# Altium project Vertex-H7.PrjPcb
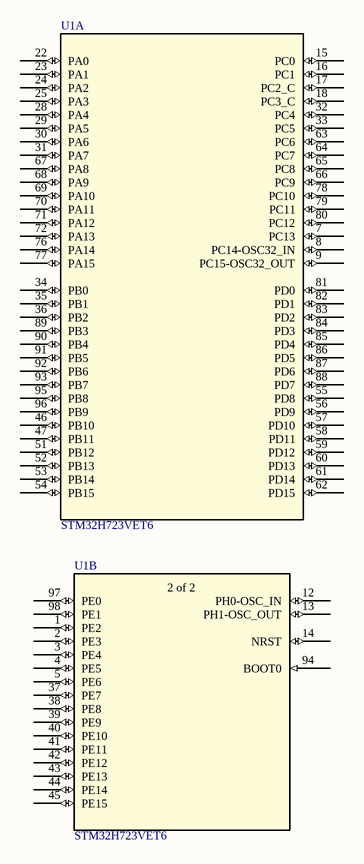
[diagram p0: MAIN.SchDoc]
4 sheets, 25 parts. Net scope: global (net labels, ports and power ports of the same name join across sheets).
Sheets:
  MAIN.SchDoc
  SDRAM.SchDoc
  POWER.SchDoc
  USB.SchDoc

## Sheet MAIN.SchDoc
size A4; SheetNumber: 1; SheetTotal: 3

### Parts
U1  STM32H723VET6  [LQFP100_STM]  (parts A,B of 3)

### Nets

Not connected (* = marked no-connect by the designer): U1 1(PE2) 2(PE3) 3(PE4) 4(PE5) 5(PE6) 7(PC13) 8(PC14-OSC32_IN) 9(PC15-OSC32_OUT) 12(PH0-OSC_IN) 13(PH1-OSC_OUT) 14(NRST) 15(PC0) 16(PC1) 17(PC2_C) 18(PC3_C) 22(PA0) 23(PA1) 24(PA2) 25(PA3) 28(PA4) 29(PA5) 30(PA6) 31(PA7) 32(PC4) 33(PC5) 34(PB0) 35(PB1) 36(PB2) 37(PE7) 38(PE8) 39(PE9) 40(PE10) 41(PE11) 42(PE12) 43(PE13) 44(PE14) 45(PE15) 46(PB10) 47(PB11) 51(PB12) 52(PB13) 53(PB14) 54(PB15) 55(PD8) 56(PD9) 57(PD10) 58(PD11) 59(PD12) 60(PD13) 61(PD14) 62(PD15) 63(PC6) 64(PC7) 65(PC8) 66(PC9) 67(PA8) 68(PA9) 69(PA10) 70(PA11) 71(PA12) 72(PA13) 76(PA14) 77(PA15) 78(PC10) 79(PC11) 80(PC12) 81(PD0) 82(PD1) 83(PD2) 84(PD3) 85(PD4) 86(PD5) 87(PD6) 88(PD7) 89(PB3) 90(PB4) 91(PB5) 92(PB6) 93(PB7) 94(BOOT0) 95(PB8) 96(PB9) 97(PE0) 98(PE1)

### Notes on the sheet
- (in symbol STM32H723VET6, part B) 2 of 2

### Library data of the parts
U1 = STM32H723VET6: High-performance and DSP with DP-FPU, Arm Cortex-M7 MCU with 512 Kbytes Flash, 564 Kbytes RAM, 550 MHz CPU, L1 cache, external memory interface, subset of peripherals; Manufacturer_Name: STMicroelectronics; Copyright: Copyright (C) 2025 Ultra Librarian. All rights reserved.; Manufacturer_Part_Number: STM32H723VET6; Datasheet: https://www.st.com/resource/en/datasheet/stm32h723ve.pdf; RefDes: RefDes; Type: Type

## Sheet SDRAM.SchDoc
size A4; SheetNumber: 2; SheetTotal: 4
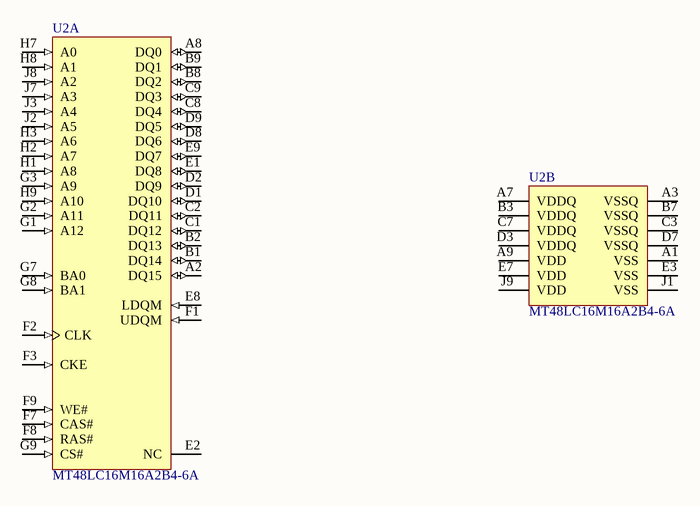
[diagram p1: SDRAM.SchDoc]

### Parts
U2  MT48LC16M16A2B4-6A  [MICT-B4-54]  (parts A,B of 2)

### Nets

Not connected (* = marked no-connect by the designer): U2 A1(VSS) A2(DQ15) A3(VSSQ) A7(VDDQ) A8(DQ0) A9(VDD) B1(DQ14) B2(DQ13) B3(VDDQ) B7(VSSQ) B8(DQ2) B9(DQ1) C1(DQ12) C2(DQ11) C3(VSSQ) C7(VDDQ) C8(DQ4) C9(DQ3) D1(DQ10) D2(DQ9) D3(VDDQ) D7(VSSQ) D8(DQ6) D9(DQ5) E1(DQ8) E2(NC) E3(VSS) E7(VDD) E8(LDQM) E9(DQ7) F1(UDQM) F2(CLK) F3(CKE) F7(CAS#) F8(RAS#) F9(WE#) G1(A12) G2(A11) G3(A9) G7(BA0) G8(BA1) G9(CS#) H1(A8) H2(A7) H3(A6) H7(A0) H8(A1) H9(A10) J1(VSS) J2(A5) J3(A4) J7(A3) J8(A2) J9(VDD)

### Library data of the parts
U2 = CMP-0351-00014-1: 256Mb PC133 SDR SDRAM, 16Mb x 16, 6ns, 3.3V, 0 to 70 degC, 54-Ball VFBGA, Pb-Free; Manufacturer: Micron; Data Rate: PC133Â; CL: CL = 3Â; Clock Rate: 166 MHzÂ; Cycle Time: 6nsÂ; Density: 256MbÂ; Voltage: 3.3VÂ; Op. Temp.: 0C to +70CÂ; PackageReference: MICT-B4-54; PartNumber: MT48LC16M16A2B4-6A; ComponentLink1URL: http://www.micron.com/; Mounting Technology: Surface Mount; DatasheetVersion: Rev.Q; ComponentLink1Description: Manufacturer URL; RoHS: YesÂ; Depth: 16MbÂ; ComponentLink2URL: http://www.micron.com/~/media/Documents/Products/Data%20Sheet/DRAM/256Mb_sdr.pdf; ComponentLink2Description: Datasheet; PackageDescription: 54-Ball Very Thin Profile Fine-Pitch Ball Grid Array, 8x 8 mm, Pitch 0.8 mm; ComponentLink3Description: Package Specification; Width: x16Â; ComponentLink3URL: http://www.micron.com/~/media/Documents/Products/Data%20Sheet/DRAM/128Mbx16x32Mobile.pdf; PackageVersion: Rev.Q

## Sheet POWER.SchDoc
size A4; SheetNumber: 3; SheetTotal: 4
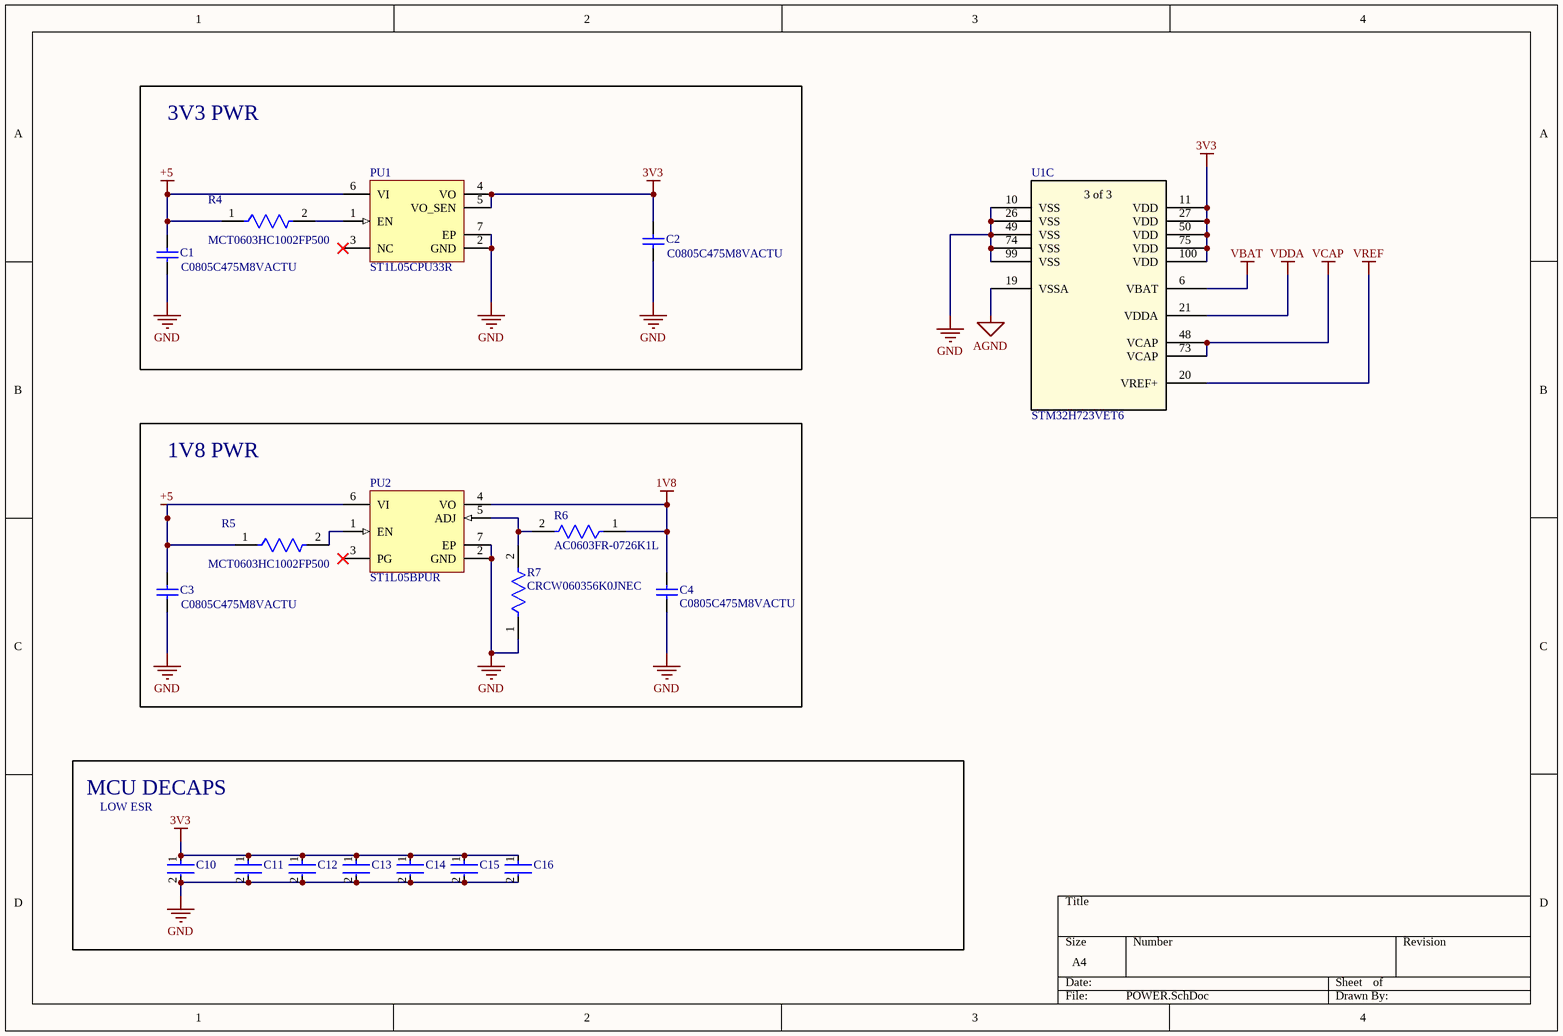
[diagram p2: POWER.SchDoc]

### Parts
C1  C0805C475M8VACTU  [CAPC2013X145X50ML20T25]
C2  C0805C475M8VACTU  [CAPC2013X145X50ML20T25]
C3  C0805C475M8VACTU  [CAPC2013X145X50ML20T25]
C4  C0805C475M8VACTU  [CAPC2013X145X50ML20T25]
C10  C0603X6S1C104K030BC  [FP-C0603-030-0_03-IPC_B]  (value not drawn)
C11  C0603X6S1C104K030BC  [FP-C0603-030-0_03-IPC_B]  (value not drawn)
C12  C0603X6S1C104K030BC  [FP-C0603-030-0_03-IPC_B]  (value not drawn)
C13  C0603X6S1C104K030BC  [FP-C0603-030-0_03-IPC_B]  (value not drawn)
C14  C0603X6S1C104K030BC  [FP-C0603-030-0_03-IPC_B]  (value not drawn)
C15  C0603X6S1C104K030BC  [FP-C0603-030-0_03-IPC_B]  (value not drawn)
C16  C0603X6S1C104K030BC  [FP-C0603-030-0_03-IPC_B]  (value not drawn)
PU1  ST1L05CPU33R  [DFN6D_N]
PU2  ST1L05BPUR  [DFN6D_M]
R4  MCT0603HC1002FP500  [FP-MCT0603-IPC_B]
R5  MCT0603HC1002FP500  [FP-MCT0603-IPC_B]
R6  AC0603FR-0726K1L  [FP-AC0603-MFG]
R7  CRCW060356K0JNEC  [FP-CRCW0603-e3-IPC_A]
U1  STM32H723VET6  [LQFP100_STM]  (part C of 3)

### Blocks framed on the sheet
3V3 PWR: C1 C2 PU1 R4
1V8 PWR: C3 C4 PU2 R5-R7
MCU DECAPS: C10-C16

### Nets
1V8: C4.2 PU2.4(VO) R6.1
3V3: C2.2 C10.1 C11.1 C12.1 C13.1 C14.1 C15.1 C16.1 PU1.4(VO) PU1.5(VO_SEN) U1.11(VDD) U1.27(VDD) U1.50(VDD) U1.75(VDD) U1.100(VDD)
+5: C1.2 C3.2 PU1.6(VI) PU2.6(VI) R4.1 R5.1
AGND: U1.19(VSSA)
GND: C1.1 C2.1 C3.1 C4.1 C10.2 C11.2 C12.2 C13.2 C14.2 C15.2 C16.2 PU1.2(GND) PU1.7(EP) PU2.2(GND) PU2.7(EP) R7.1 U1.10(VSS) U1.26(VSS) U1.49(VSS) U1.74(VSS) U1.99(VSS)
VBAT: U1.6(VBAT)
VCAP: U1.48(VCAP) U1.73(VCAP)
VDDA: U1.21(VDDA)
VREF: U1.20(VREF+)
NetPU1_1: PU1.1(EN) R4.2
NetPU2_1: PU2.1(EN) R5.2
NetPU2_5: PU2.5(ADJ) R6.2 R7.2

Not connected (* = marked no-connect by the designer): PU1 3(NC)*; PU2 3(PG)*

### Notes on the sheet
- LOW ESR
- (in symbol STM32H723VET6, part C) 3 of 3

### Library data of the parts
C1-C4 = CMP-2007-01267-1: Manufacturer: Kemet; Part Number: C0805C475M8VACTU
C10-C16 = CMP-08246-003275-1: Multilayer Ceramic Capacitors 100nF ±10% 16V X6S SMD 0201; Max Operating Temperature: 105°C; Tolerance: 10%; Termination: SMD/SMT; Mount: Surface Mount; Case Code (Imperial): 0201; Package Quantity: 1; RoHS Compliant: Yes; Voltage Rating (DC): 16V; Capacitance: 100nF; REACH SVHC: No SVHC; Lead Free: Lead Free; Min Operating Temperature: -55°C; Dielectric Material: Ceramic; Dielectric: X6S; Case/Package: 0201; Length: 0.024inch; Weight: 6E-06oz; Case Code (Metric): 0603; Width: 0.3mm; Voltage Rating: 16V; Height: 0.3mm; Packaging: Tape and Reel; Thickness: 0.013inch
PU1 = CMP-0244-00293-1: Very Low Quiescent BiCMOS Voltage Regulator, 3.3V, 6-Pin VFDFPN, Tape and Reel; ComponentLink2Description: Datasheet; ComponentLink1Description: Manufacturer URL; ComponentLink2URL: http://www.st.com/internet/com/TECHNICAL_RESOURCES/TECHNICAL_LITERATURE/DATASHEET/CD00186925.pdf; PackageVersion: 2008; PackageReference: DFN6D; PackageDescription: 6-Pin Plastic, Dual LLP, 3 x 3 mm Body, 0.95 mm Pitch, Exposed Pad; DatasheetVersion: 1/09/2009; ComponentLink1URL: http://www.st.com
PU2 = CMP-0244-00292-1: Very Low Quiescent BiCMOS Voltage Regulator, Adjustable Vo, 6-Pin VFDFPN, Tape and Reel; PackageDescription: 6-Pin Plastic, Dual LLP, 3 x 3 mm Body, 0.95 mm Pitch, Exposed Pad; ComponentLink2Description: Datasheet; ComponentLink2URL: http://www.st.com/internet/com/TECHNICAL_RESOURCES/TECHNICAL_LITERATURE/DATASHEET/CD00186925.pdf; ComponentLink1Description: Manufacturer URL; DatasheetVersion: 1/09/2009; PackageReference: DFN6D; PackageVersion: 2008; ComponentLink1URL: http://www.st.com
R4 R5 = CMP-02407-001090-1: RES SMD 100 OHM 1% 1/8W 0603
R6 = CMP-03412-013200-2: RES 26.1KΩ 1.00% 0.1W 0603; Power Rating: 100mW; Temperature Coefficient: 100ppm/°C; Resistance: 26.1kR; Voltage Rating: 50V; Tolerance: 1%; Length: 0.063inch; Height: 0.022inch; Max Operating Temperature: 155°C; Width: 0.8mm; Weight: 7.1E-05oz; Case/Package: 0603; Number of Terminations: 2; Resistor Type: Thick Film; Min Operating Temperature: -55°C; Max Power Dissipation: 100mW; Features: Moisture Resistant; Case Code (Metric): 1608; Packaging: Tape and Reel; RoHS Compliant: Yes; Termination: SMD/SMT; Series: AC; Case Code (Imperial): 0603
R7 = CMP-02407-010749-1: RES Thick Film, 56kΩ, 5%, 0.1W, 200ppm/°C, 0603; Max Power Dissipation: 100mW; Resistance: 56kR; Max Operating Temperature: 155°C; Features: Automotive AEC-Q200; Height: 0.02inch; Lead Free: Lead Free; Min Operating Temperature: -55°C; Packaging: Tape and Reel; Length: 0.061inch; Composition: Thick Film; Tolerance: 5%; Width: 0.033inch; Temperature Coefficient: 200ppm/°C; Case/Package: 0603; Number of Terminations: 2; Package Quantity: 20000
U1 = STM32H723VET6: as U1 on sheet MAIN; Copyright: Copyright (C) 2025 Ultra Librarian. All rights reserved.; Manufacturer_Part_Number: STM32H723VET6; Datasheet: https://www.st.com/resource/en/datasheet/stm32h723ve.pdf; RefDes: RefDes; Type: Type

## Sheet USB.SchDoc
size A4; SheetNumber: 4; SheetTotal: 4
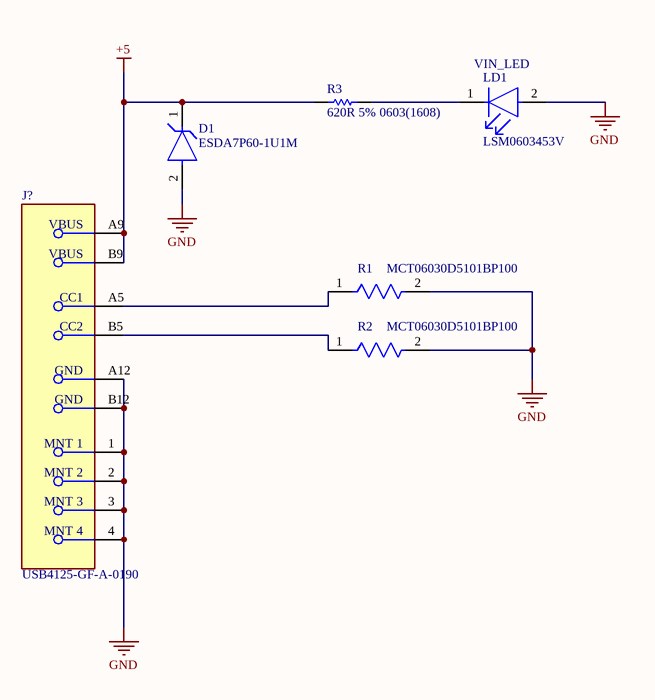
[diagram p3: USB.SchDoc]

### Parts
D1  ESDA7P60-1U1M  [FP-1610-MFG]
J?  USB4125-GF-A-0190  [FP-USB4125-GF-A-0190-MFG]
LD1  LSM0603453V  [FP-LSM0603453V-MFG]
R1  MCT06030D5101BP100  [FP-MCT0603-IPC_B]
R2  MCT06030D5101BP100  [FP-MCT0603-IPC_B]
R3  620R 5% 0603(1608)  [RESC0603(1608)_M]

### Nets
+5: D1.1(C) J?.A9(VBUS) J?.B9(VBUS) R3.1
GND: D1.2(A) J?.1(MNT_1) J?.2(MNT_2) J?.3(MNT_3) J?.4(MNT_4) J?.A12(GND) J?.B12(GND) LD1.2(A) R1.2 R2.2
NetJ?_A5: J?.A5(CC1) R1.1
NetJ?_B5: J?.B5(CC2) R2.1
NetLD1_1: LD1.1(C) R3.2

### Notes on the sheet
- (near LD1) VIN_LED

### Library data of the parts
D1 = CMP-12225-000013-1: TVS DIODE 5V 11.6V 1610; Manufacturer: STMicroelectronics; Number Of Channels: 1; Standoff Height: 0mm; Breakdown Voltage: 6.4V; Direction: Unidirectional; Clamping Voltage: 10.2V; Peak Pulse Power: 700W; Peak Pulse Current: 60A; Description: 11.6V Clamp 60A (8/20µs) Ipp Tvs Diode Surface Mount 1610; Max Junction Temp: +150°C; ComponentLink2Description: Datasheet; Temperature Range Low: -55°C; Package: 1610; Lead Free: Yes; Temperature Range High: +150°C; Temperature: -55°C to +150°C; Device Class L2: TVS Diodes; Category: Diode; Device Class L1: Circuit Protection; Manufacturer Part Number: ESDA7P60-1U1M; Digikey Description: TVS DIODE 5V 11.6V 1610; ComponentLink2URL: http://www.st.com/content/ccc/resource/technical/document/datasheet/44/e9/26/44/42/ee/4f/e5/DM00139972.pdf/files/DM00139972.pdf/jcr:content/translations/en.DM00139972.pdf; Reverse Standoff Voltage: 5V; RoHS: TRUE; Octopart: https://octopart.com/esda7p60-1u1m-stmicroelectronics-52112702; Height: 0.65mm; Device Class L3: unset; Automotive: No
J? = CMP-245163-000004-1: CONN RCPT TYPE C 6P SMD RA
LD1 = CMP-00731-94024739-1: LSM0603453V LED SM 0603 3V -/1000/-mcd Green; Forward Current: 20mA; Forward Voltage: 2.3V; Viewing Angle: 120°; Reverse Voltage: 5V; Power Dissipation: 60mW; Wavelength: 576nm; Luminous Intensity: 120mcd; NexarPartId: 94024739; Height: 550µm; Max Operating Temperature: 85°C; Schedule B: 8541402000, 8541406050; Case/Package: 0603; Color: Green; Min Operating Temperature: -40°C
R1 R2 = CMP-02407-000449-1: RES SMD 100 OHM 1% 1/8W 0603; Resistance: 5.1kR; Min Operating Temperature: -55°C; Lead Free: Lead Free; Military Standard: Not; Max Operating Temperature: 125°C; Length: 1.55mm; Width: 850um; Case/Package: 0603; Composition: Thin Film; Packaging: Tape and Reel; Depth: 0.85mm
R3 = CMP-1012-00069-1: 620R 0.1W 5% 0603 (1608 Metric)  SMD; Case-Metric: 1608; Value: 620.00 Ohm; Case-EIA: 0603; Tolerance: 5 %; Technology: SMT; Power: 0.1 W

## Nets that join several sheets
+5: POWER (6 pins), USB (D1.1 J?.A9 J?.B9 R3.1)
GND: POWER (21 pins), USB (10 pins)